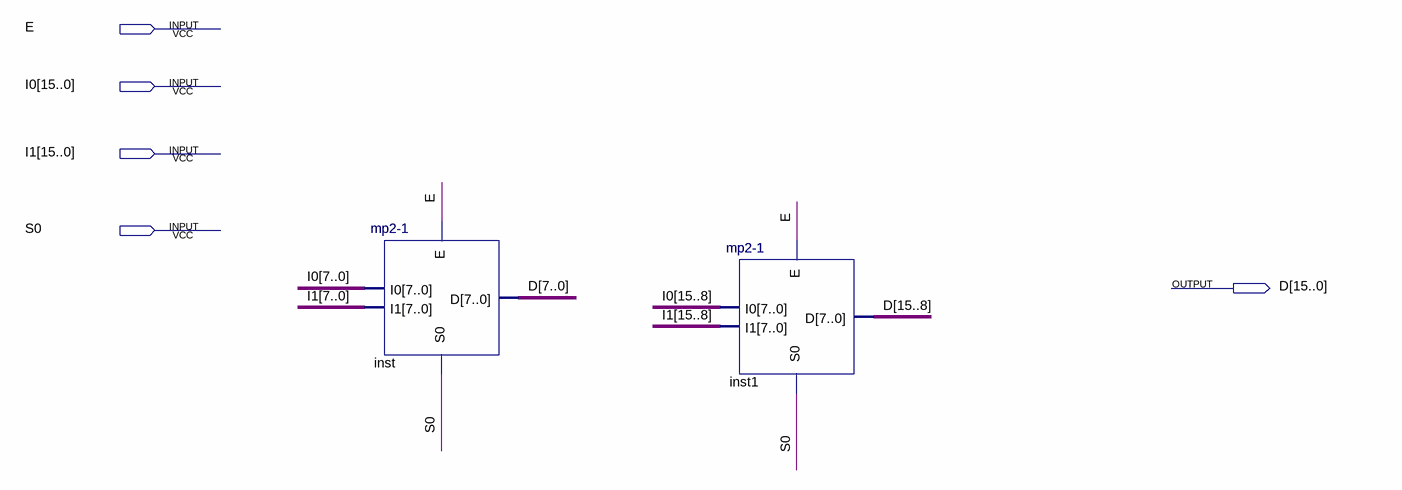
[diagram p0: schematic sheet]
// Quartus schematic mp16_2-1.bdf as structural Verilog: 2 symbols, 5 pins
module \mp16_2-1  (
  input  E,
  input  [15:0] I0,
  input  [15:0] I1,
  input  S0,
  output [15:0] D
);

  \mp2-1  inst (.E(E), .S0(S0), .I0(I0[7:0]), .I1(I1[7:0]), .D(D[7:0]));
  \mp2-1  inst1 (.E(E), .S0(S0), .I0(I0[15:8]), .I1(I1[15:8]), .D(D[15:8]));
endmodule
